# Altium project 5VV10 AND BUCK.PrjPcb
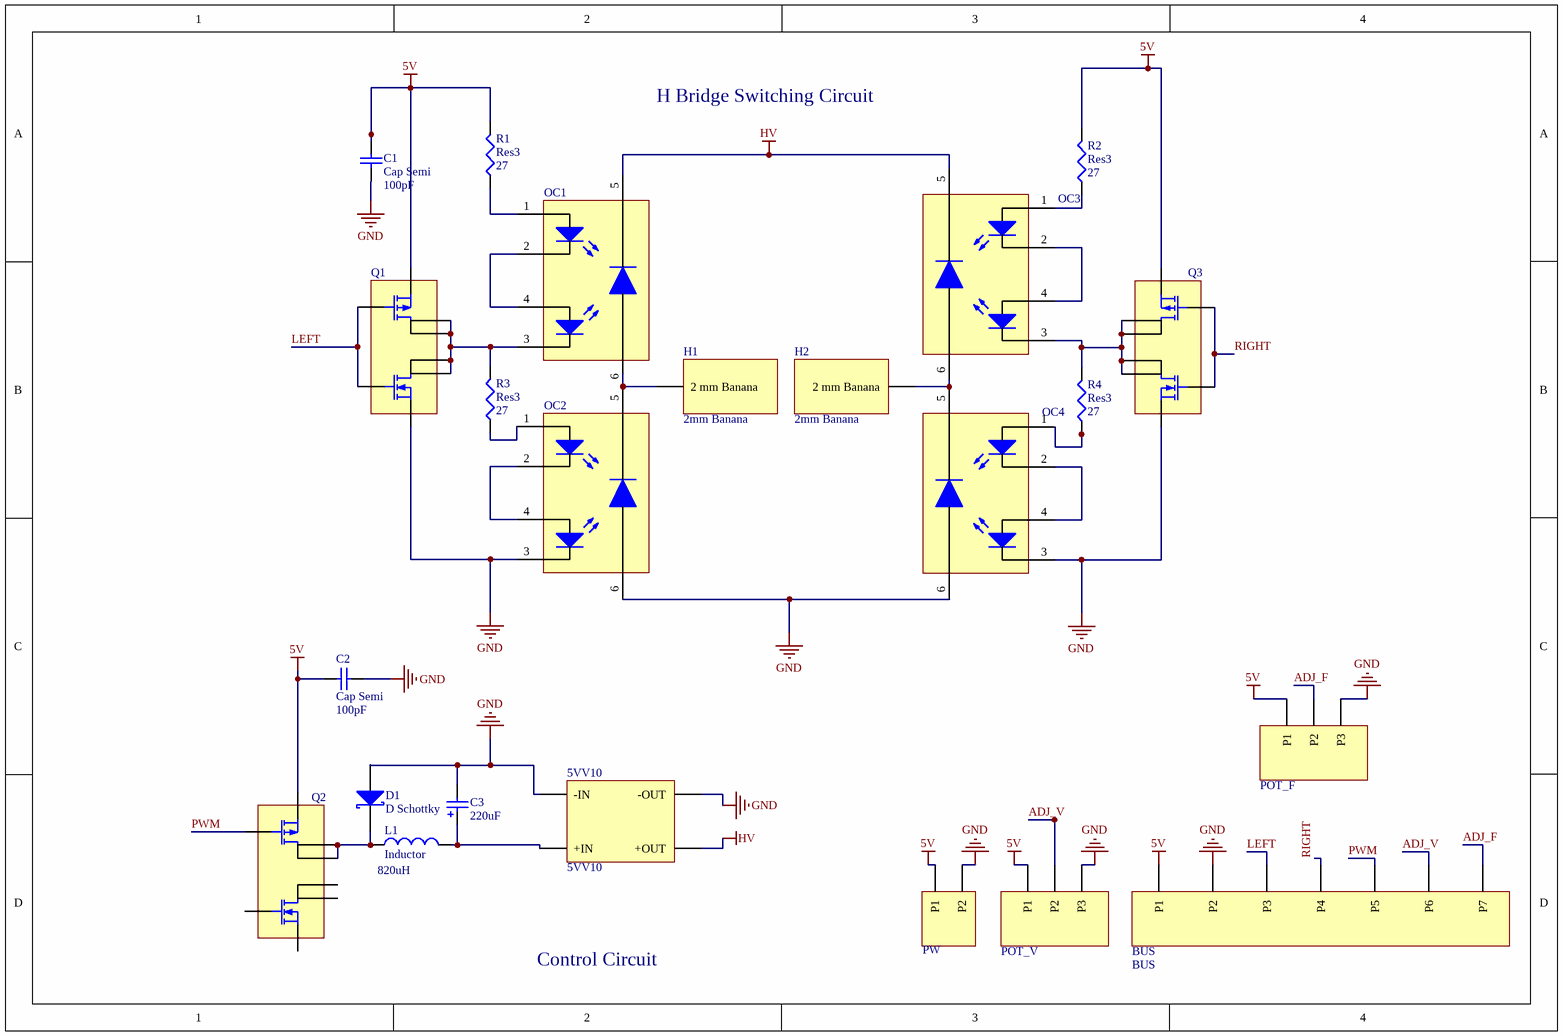
[diagram p0: 5VV10 AND BUCK.SchDoc]
1 sheet, 23 parts. Net scope: global (net labels, ports and power ports of the same name join across sheets).
Board file: 5VV10 AND BUCK.PcbDoc

## Sheet 5VV10 AND BUCK.SchDoc
size A4; PageSetup: Record=PageOptions|CenterHorizontal=True|CenterVertical=True|PrintScale=0.97|XCorrection=1.00|YCorrection=1.00|PrintKind=0|BorderSize=5000000|LeftOffset=0|BottomOffset=0|Orientation=2|PaperLength=1000|PaperWidth=1000|Scale=100|PaperSource=15|PrintQuality=-3|MediaType=1|DitherType=10|PrintScaleMode=1|PaperKind=A4|PaperIndex=9

### Parts
5VV10  5VV10  [PCBComponent_1]
BUS  BUS  [WJ350_7_Pins]
C1  Cap Semi  value 100pF  [C1206]
C2  Cap Semi  value 100pF  [C1206]
C3  value 220uF  [SMD 7343 - Pol]  (hidden comment: Capacitor 220uF (Polarized))
D1  D Schottky  [SMB]
H1  2mm Banana  [PCBComponent_1]
H2  2mm Banana  [PCBComponent_1]
L1  Inductor  value 820uH  [PCBComponent_1]
OC1  Optocoupler  [OC100G]  (value not drawn)
OC2  Optocoupler  [OC100G]  (value not drawn)
OC3  Optocoupler  [OC100G]  (value not drawn)
OC4  Optocoupler  [OC100G]  (value not drawn)
POT_F  POT  [WJ350_3_Pins]  (value not drawn)
POT_V  POT  [WJ350_3_Pins]  (value not drawn)
PW  PW  [WJ350_2_Pins]  (value not drawn)
Q1  Dual MOSFET  [SO-8]  (value not drawn)
Q2  Dual MOSFET  [SO-8]  (value not drawn)
Q3  Dual MOSFET  [SO-8]  (value not drawn)
R1  Res3  value 27  [14-1210]
R2  Res3  value 27  [14-1210]
R3  Res3  value 27  [14-1210]
R4  Res3  value 27  [14-1210]

### Nets
5V: BUS.P1 C1.2 C2.1 POT_F.P1 POT_V.P1 PW.P1 Q1.3 Q2.3 Q3.3 R1.2 R2.2
GND: 5VV10.1(-IN) 5VV10.4(-OUT) BUS.P2 C1.1 C2.2 C3.2 D1.1(A) OC2.3(K) OC2.6(A) OC4.3(K) OC4.6(A) POT_F.P3 POT_V.P3 PW.P2 Q1.1 Q3.1
HV: 5VV10.3(+OUT) OC1.5(K) OC3.5(K)
ADJ_F: BUS.P7 POT_F.P2
ADJ_V: BUS.P6 POT_V.P2
LEFT: BUS.P3 Q1.2 Q1.4
PWM: BUS.P5 Q2.4
RIGHT: BUS.P4 Q3.2 Q3.4
Net5VV10_2: 5VV10.2(+IN) C3.1 L1.2
NetD1_2: D1.2(K) L1.1 Q2.5 Q2.6
NetH1_1: H1.1(2_mm_Banana) OC1.6(A) OC2.5(K)
NetH2_1: H2.1(2_mm_Banana) OC3.6(A) OC4.5(K)
NetOC1_1: OC1.1(A) R1.1
NetOC1_2: OC1.2(K) OC1.4(A)
NetOC1_3: OC1.3(K) Q1.5 Q1.6 Q1.7 Q1.8 R3.2
NetOC2_1: OC2.1(A) R3.1
NetOC2_2: OC2.2(K) OC2.4(A)
NetOC3_1: OC3.1(A) R2.1
NetOC3_2: OC3.2(K) OC3.4(A)
NetOC3_3: OC3.3(K) Q3.5 Q3.6 Q3.7 Q3.8 R4.2
NetOC4_1: OC4.1(A) R4.1
NetOC4_2: OC4.2(K) OC4.4(A)

Not connected (* = marked no-connect by the designer): Q2 1 2 7 8

### Notes on the sheet
- H Bridge Switching Circuit
- Control Circuit

### Library data of the parts
5VV10 = 5VV10: Mnf: Pico Electronics
BUS = WJ350_6_Pins
C1 C2 = Cap Semi: Capacitor (Semiconductor SIM Model); Published: 8-Jun-2000; LatestRevisionDate: 29-May-2009; LatestRevisionNote: IPC-7351 Footprint Added.; PackageReference: C1206; Publisher: Altium Limited; PackageDescription: Chip Capacitor
D1 = D Schottky: Schottky Diode; Published: 8-Jun-2000; LatestRevisionDate: 17-Jul-2002; LatestRevisionNote: Re-released for DXP Platform.; PackageReference: SMB; Publisher: Altium Limited; PackageDescription: DO-214-AA/SMB; 2 C-Bend Leads; Body 5.3 x 3.6 mm, inc. leads (LxW); Code_JEDEC: DO-214-AA
L1 = 820u
OC1-OC4 = Optocoupler: Manufacturer OC100G MPI distribution OC100G
POT_F POT_V = WJ350_3_Pins
PW = WJ350_2_Pins
Q1-Q3 = Dual MOSFET: Manufacturer FDS8858CZ Farnell 1498963
R1-R4 = Res3: Resistor; Published: 8-Jun-2000; LatestRevisionDate: 29-May-2009; LatestRevisionNote: IPC-7351 Footprint Added.; PackageReference: J1-0603; Publisher: Altium Limited; PackageDescription: Chip Resistor
C3 = Capacitor 220uF (Polarized): Published: 8-Jun-2000; LatestRevisionDate: 17-Jul-2002; LatestRevisionNote: Re-released for DXP Platform.; PackageReference: RB7.6-15; Publisher: Altium Limited; PackageDescription: Polarized Capacitor (Radial); 2 Leads